# Altium schematic sheet lab1_kuchenov_usb_spi.SchDoc: =title_line_1 + title_line_2
size 594 x 420 mm; SheetNumber: n
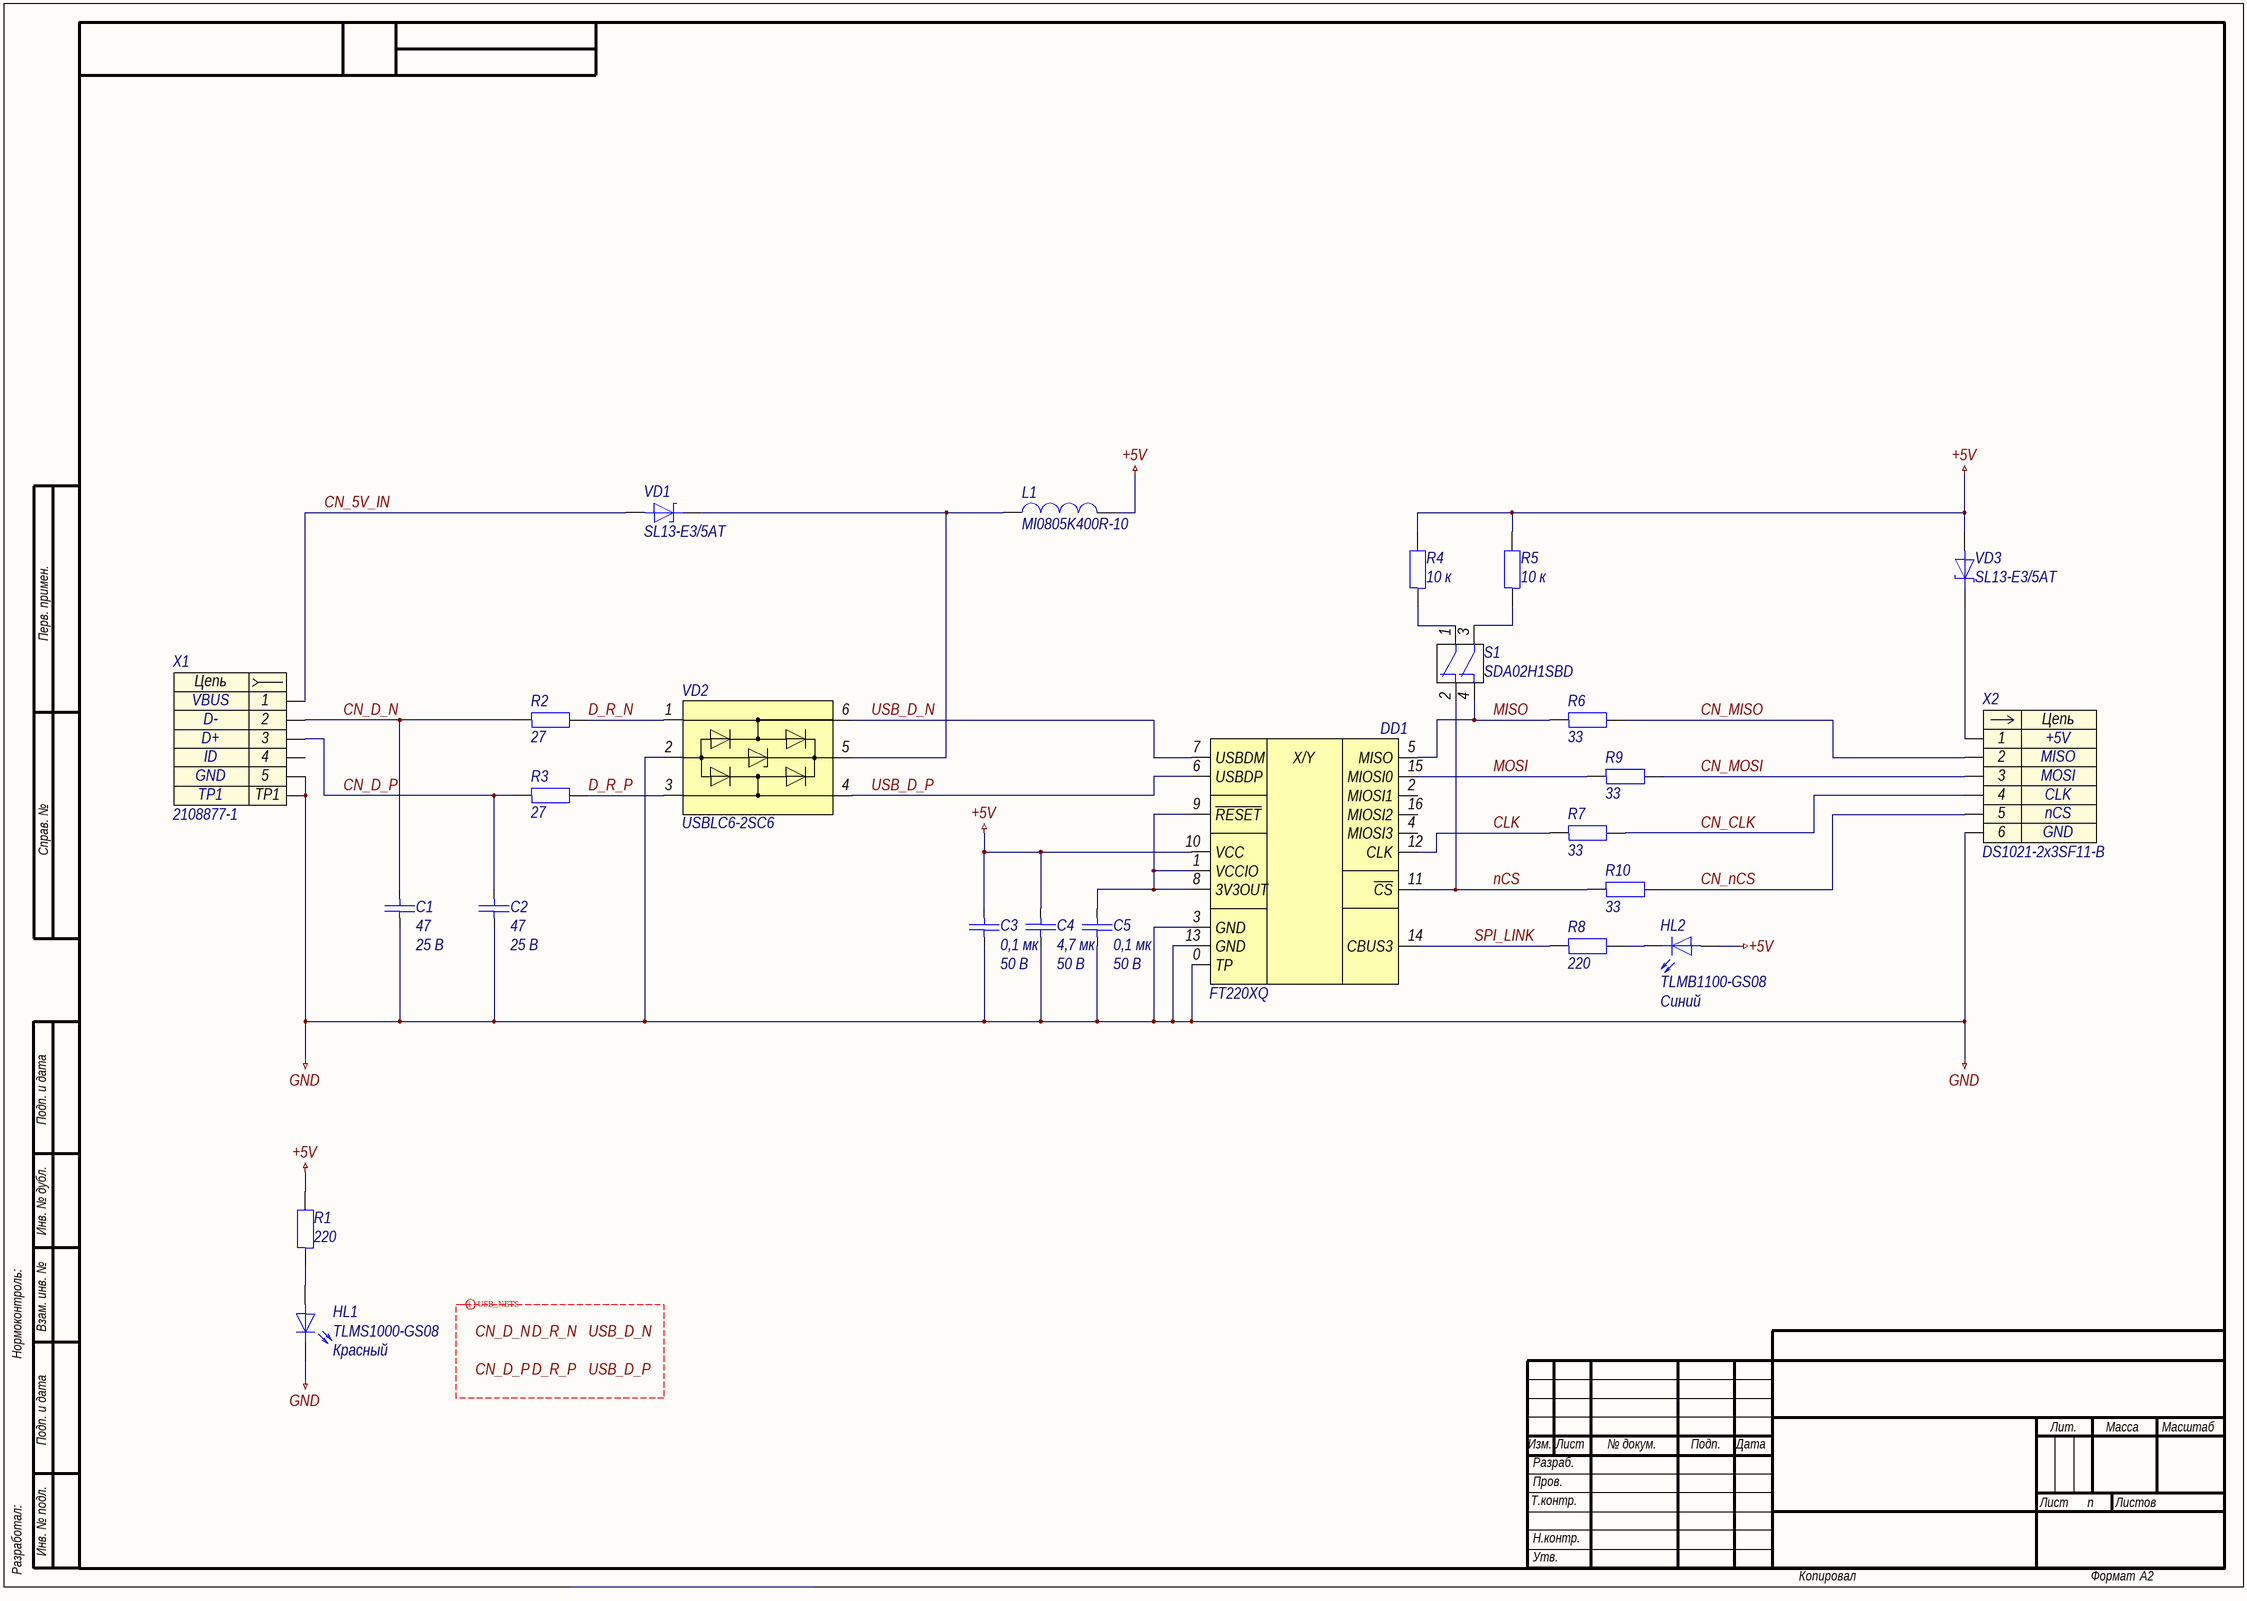
[diagram p0: lab1_kuchenov_usb_spi.SchDoc]

## Parts
C1  47  Напряжение: 25 В  [C0201]
C2  47  Напряжение: 25 В  [C0201]
C3  0,1 мк  Напряжение: 50 В  [C0603]
C4  4,7 мк  Напряжение: 50 В  [C0805]
C5  0,1 мк  Напряжение: 50 В  [C0603]
DD1  FT220XQ  [QFN-16-400X400X90]
HL1  TLMS1000-GS08  Colour: Красный  [HL0603]
HL2  TLMB1100-GS08  Colour: Синий  [HL0603]
L1  MI0805K400R-10  [MI-2-0805]
R1  220  [R0603]
R2  27  [R0603]
R3  27  [R0603]
R4  10 к  [R0603]
R5  10 к  [R0603]
R6  33  [R0603]
R7  33  [R0603]
R8  220  [R0603]
R9  33  [R0603]
R10  33  [R0603]
S1  SDA02H1SBD  [SDA02H1SBD]
VD1  SL13-E3/5AT  [DO-214AC]
VD2  USBLC6-2SC6  [SOT23-6L]
VD3  SL13-E3/5AT  [DO-214AC]
X1  2108877-1  [2108877-1]
X2  DS1021-2x3SF11-B  [DS1021-2X3SF11-B]

## Nets
+5V: C3.1 C4.2 DD1.10(VCC) HL2.2 L1.2 R1.2 R4.2 R5.2 VD3.2
GND: C1.2 C2.2 C3.2 C4.1 C5.2 DD1.0(TP) DD1.3(GND) DD1.13(GND) HL1.1 VD2.2 X1.5 X1.TP1 X2.6
CLK: DD1.12(CLK) R7.1
CN_5V_IN: VD1.2 X1.1
CN_CLK: R7.2 X2.4
CN_D_N: C1.1 R2.1 X1.2
CN_D_P: C2.1 R3.1 X1.3
CN_MISO: R6.2 X2.2
CN_MOSI: R9.2 X2.3
CN_nCS: R10.2 X2.5
D_R_N: R2.2 VD2.1
D_R_P: R3.2 VD2.3
MISO: DD1.5(MISO) R6.1 S1.4
MOSI: DD1.15(MIOSI0) R9.1
nCS: DD1.11(~{CS}) R10.1 S1.2
SPI_LINK: DD1.14(CBUS3) R8.1
USB_D_N: DD1.7(USBDM) VD2.6
USB_D_P: DD1.6(USBDP) VD2.4
NetC5_1: C5.1 DD1.1(VCCIO) DD1.8(3V3OUT) DD1.9(~{RESET})
NetHL1_2: HL1.2 R1.1
NetHL2_1: HL2.1 R8.2
NetL1_1: L1.1 VD1.1 VD2.5
NetR4_1: R4.1 S1.1
NetR5_1: R5.1 S1.3
NetVD3_1: VD3.1 X2.1

Not connected (* = marked no-connect by the designer): DD1 2(MIOSI1) 4(MIOSI3) 16(MIOSI2); X1 4

## Layout directives
differential pair; rule Differential Pairs Routing [Pref Gap = 0.254mm    Min Gap  = 0.15mm    Max Gap  = 0.254mmPref Width = 0.381mm    Min Width  = 0.155mm    Max Width  = 0.381mm]; differential pair class USB_SIGNALS: CN_D_N, CN_D_P, D_R_N, D_R_P, USB_D_N, USB_D_P

## Notes on the sheet
- Labels drawn without touching a wire or pin: CN_D_N, CN_D_P, D_R_N, D_R_P, USB_D_N, USB_D_P
- Перв. примен.
- Справ. №
- Подп. и дата
- Инв. № дубл.
- Нормоконтроль:
- Взам. инв. №
- Изм.
- Лист
- № докум.
- Подп.
- Дата
- Лит.
- Масса
- Масштаб
- Т.контр.
- Пров.
- Разраб.
- Листов
- Разработал:
- Инв. № подл.
- Н.контр.
- Утв.
- Копировал
- Формат
- А2
- (in symbol dd0022) X/Y
- (in symbol x0001) Цепь
- (in symbol x0015) Цепь

## Library data of the parts
C1 C2 = c0003: =Описание; ID: c0003; Фамилия: Козлов; Описание: Конденсатор чип 0201 47 пФ 25 В ±5 %; Наименование: CL03C470JA3NNNC; Производитель: Samsung Electro-Mechanics; Отклонение: ±5 %; Рабочие температуры: от –55 °С до +125 °С; Температурный коэффициент емкости: C0G; Корпус: 0201; Номинал: 47; Номинальное напряжение: 25 В; HelpURL: http://product.samsungsem.com/mlcc/CL03C470JA3NNN.do
C3 C5 = c0060: =Описание; ID: c0060; Фамилия: Ларионов; Описание: Конденсатор чип 0603 100 нФ 50 В ±5 %; Наименование: CC0603JRX7R9BB104; Производитель: YAGEO Corp.; Отклонение: ±5 %; Рабочие температуры: от –55 °С до +125 °С; Температурный коэффициент емкости: X7R; Корпус: 0603; Номинал: 0,1 мк; Номинальное напряжение: 50 В; HelpURL: https://www.yageo.com/upload/media/product/productsearch/datasheet/mlcc/UPY-GPHC_X7R_6.3V-to-50V_20.pdf
C4 = c0113: =Описание; ID: c0113; Фамилия: Паньков; Описание: Конденсатор чип 0805 4,7 мкФ 50 В ±10 %; Наименование: CC0805KKX5R9BB475; Производитель: YAGEO Corp.; Отклонение: ±10 %; Рабочие температуры: от –55 °С до +85 °С; Температурный коэффициент емкости: X5R; Корпус: 0603; Номинал: 4,7 мк; Номинальное напряжение: 50 В; HelpURL: https://www.yageo.com/upload/media/product/productsearch/datasheet/mlcc/UPY-GPHC_X5R_4V-to-50V_26.pdf
DD1 = dd0022: =Описание; ID: dd0022; Фамилия: Кученов; Описание: Преобразователь USB-SPI; Производитель: FTDI Limited; Корпус: QFN-16; Наименование: FT220XQ; HelpURL: https://ftdichip.com/products/ft220xq/
HL1 = hl0001: =Описание; ID: hl0001; Фамилия: Ларионов; Описание: Светодиод чип 0603 красный; Производитель: Vishay Intertechnology, Inc.; Номинальная сила света: 4 мкд; Номинальная длина волны: 628 нм; Номинальный прямой ток: 15 мА; Номинальное падение напряжения: 1,8 В; Рассеиваемая мощность: 40 мВт; Рабочие температуры: от –40 °С до +100 °С; Корпус: 0603; Наименование: TLMS1000-GS08; Цвет: Красный; HelpURL: https://www.vishay.com/leds/list/product-83172/
HL2 = hl0006: =Описание; ID: hl0006; Фамилия: Ларионов; Описание: Светодиод чип 0603 синий; Производитель: Vishay Intertechnology, Inc.; Номинальная сила света: 5 мкд; Номинальная длина волны: 466 нм; Номинальный прямой ток: 30 мА; Номинальное падение напряжения: 3,9 В; Рассеиваемая мощность: 90 мВт; Рабочие температуры: от –40 °С до +100 °С; Корпус: 0603; Примечание: Not for new design; Наименование: TLMB1100-GS08; Цвет: Синий; HelpURL: https://www.vishay.com/leds/list/product-83173/
L1 = l0003: =Описание; ID: l0003; Фамилия: Кученов; Описание: Ферритовая бусина 40 Ом ±25 %; Производитель: Laird Technologies, Inc.; Сопротивление, 100 МГц: 40 Ом; Отклонение, 100 МГц: ±25 %; Сопротивление при постоянном токе: 0,05 Ом; Рабочие температуры: от –40 °С до +125 °С; Корпус: 0805; Наименование: MI0805K400R-10; HelpURL: https://www.laird.com/products/inductive-components-emc-components-and-ferrite-cores/ferrite-chip-beads/0805-series/mi0805k400r-10
R1 R8 = r0009: =Описание; ID: r0009; Фамилия: Ларионов; Описание: Резистор чип 0603 220 Ом ±1 % 0,1 Вт; Наименование: RC0603FR-07220RL; Производитель: YAGEO Corp.; Отклонение: ±1 %; Номинальное напряжение: 75 В; Рабочие температуры: от -55 °С до +155 °С; Номинальный ток: 1 А; Корпус: 0603; Номинал: 220; HelpURL: https://www.yageo.com/upload/media/product/productsearch/datasheet/rchip/PYu-RC_Group_51_RoHS_L_11.pdf
R2 R3 = r0001: =Описание; ID: r0023; Фамилия: Кученов; Описание: Резистор чип 0603 27 Ом ±1 % 0,1 Вт; Наименование: RC0603FR-0727RL; Производитель: YAGEO Corp.; Отклонение: ±1 %; Номинальное напряжение: 75 В; Рабочие температуры: от -55 °С до +155 °С; Номинальный ток: 1 А; Корпус: 0603; Номинал: 27; HelpURL: https://www.yageo.com/upload/media/product/productsearch/datasheet/rchip/PYu-RC_Group_51_RoHS_L_11.pdf
R4 R5 = r0013: =Описание; ID: r0013; Фамилия: Самарин; Описание: Резистор чип 0603 10 кОм ±1 % 0,1 Вт; Наименование: RC0603FR-0710KL; Производитель: YAGEO Corp.; Отклонение: ±1 %; Номинальное напряжение: 75 В; Рабочие температуры: от -55 °С до +155 °С; Номинальный ток: 1 А; Корпус: 0603; Номинал: 10 к; HelpURL: https://www.yageo.com/upload/media/product/productsearch/datasheet/rchip/PYu-RC_Group_51_RoHS_L_11.pdf
R6 R7 R9 R10 = r0005: =Описание; ID: r0005; Фамилия: Козлов; Описание: Резистор чип 0603 33 Ом ±1 % 0,1 Вт; Наименование: AA0603FR-0733RL; Производитель: YAGEO Corp.; Отклонение: ±1 %; Номинальное напряжение: 75 В; Рабочие температуры: от -55 °С до +155 °С; Номинальный ток: 1 А; Корпус: 0603; Номинал: 33; HelpURL: https://www.yageo.com/upload/media/product/productsearch/datasheet/rchip/PYu-AA_51_RoHS_L_3.pdf
S1 = s0006: =Описание; ID: s0006; Фамилия: Козлов; Описание: 2-х позиционный движковый переключатель; Производитель: C&K; Ток нагрузки: 100 мА @ 5 В; Сопротивление контакта: 50 мОм; Количество контактов: 4; Рабочие температуры: от –40 °С до +85 °С; Промывка: Запрещена; Корпус: 7,06 х 9,30 х 5,45; Наименование: SDA02H1SBD; HelpURL: https://www.ckswitches.com/products/switches/product-details/DIP/SDA/SDA02H1SBD/
VD1 VD3 = vd0003: =Описание; ID: vd0003; Фамилия: Ларионов; Описание: Диод Шоттки 30 В 1,5 А; Производитель: Vishay Intertechnology, Inc.; Максимальное прямое напряжение: 0,445 В; Максимальное обратное напряжение: 30 В; Максимальный прямой ток: 1,5 А; Рабочие температуры: от –55 °С до +125 °С; Наименование: SL13-E3/5AT; Корпус: DO-214AC; HelpURL: https://www.vishay.com/product?docid=88740
VD2 = vd0004: =Описание; ID: vd0004; Фамилия: Ларионов; Описание: Диодная сборка для подавления помех, от 6 В; Производитель: STMicroelectronics; Наименование: USBLC6-2SC6; Корпус: SOT23-6L; HelpURL: https://www.st.com/content/st_com/en/products/protection-devices/esd-protection/usb-port-protection/usblc6-2.html
X1 = x0001: Contact_1: VBUS; Contact_2: D-; Contact_3: D+; Contact_4: ID; Contact_5: GND; ID: x0001; Фамилия: Ларионов; Описание: USB 2.0 Micro USB Type B IP68 гнездо прямой угол; Производитель: TE Connectivity; Наименование: 2108877-1; HelpURL: https://www.te.com/global-en/product-2108877-1.html
X2 = x0015: =Описание; Contact_1: +5V; Contact_2: MISO; Contact_3: MOSI; Contact_4: CLK; Contact_5: nCS; Contact_6: GND; ID: x0015; Фамилия: Самарин; Описание: PLS 2x3 pin 2,54 мм вилка прямой; Производитель: Connfly Electronic Co., Ltd.; Наименование: DS1021-2x3SF11-B; HelpURL: http://en.connfly.group/product/xVkr=EusQssAN0gN=Aos=mU+UrVkR9kqEAN0gN9g+WqANB+A